# EAGLE board BoardSchem (EAGLE 9.6.2)
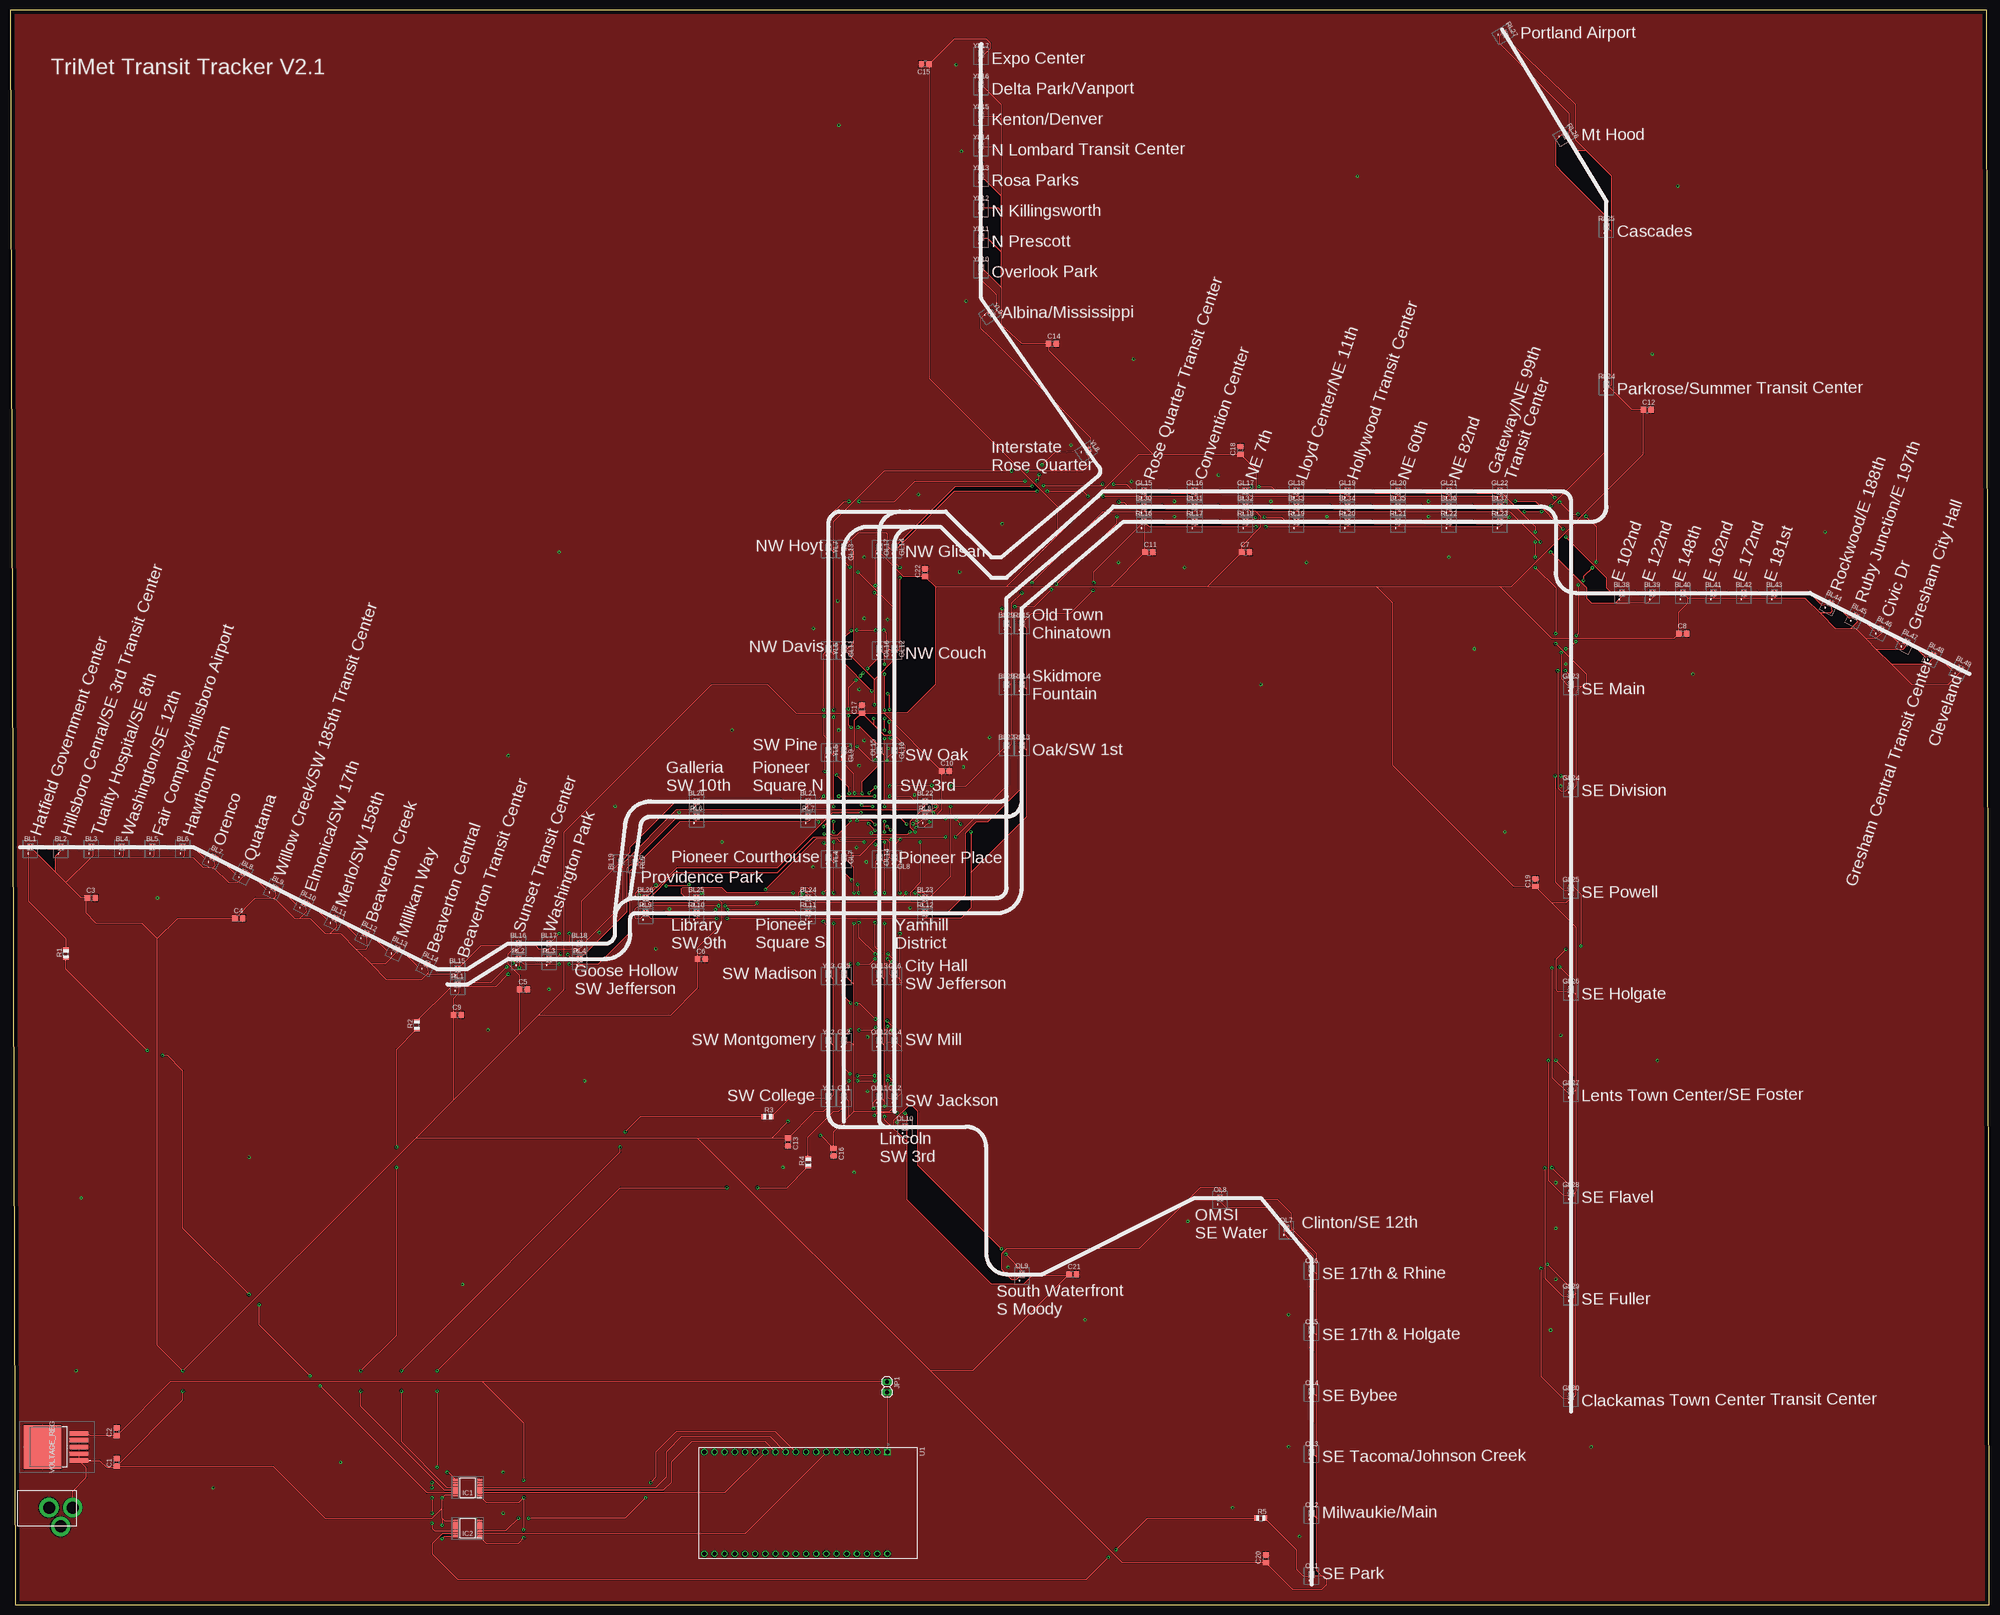
[diagram p15: board, top side]
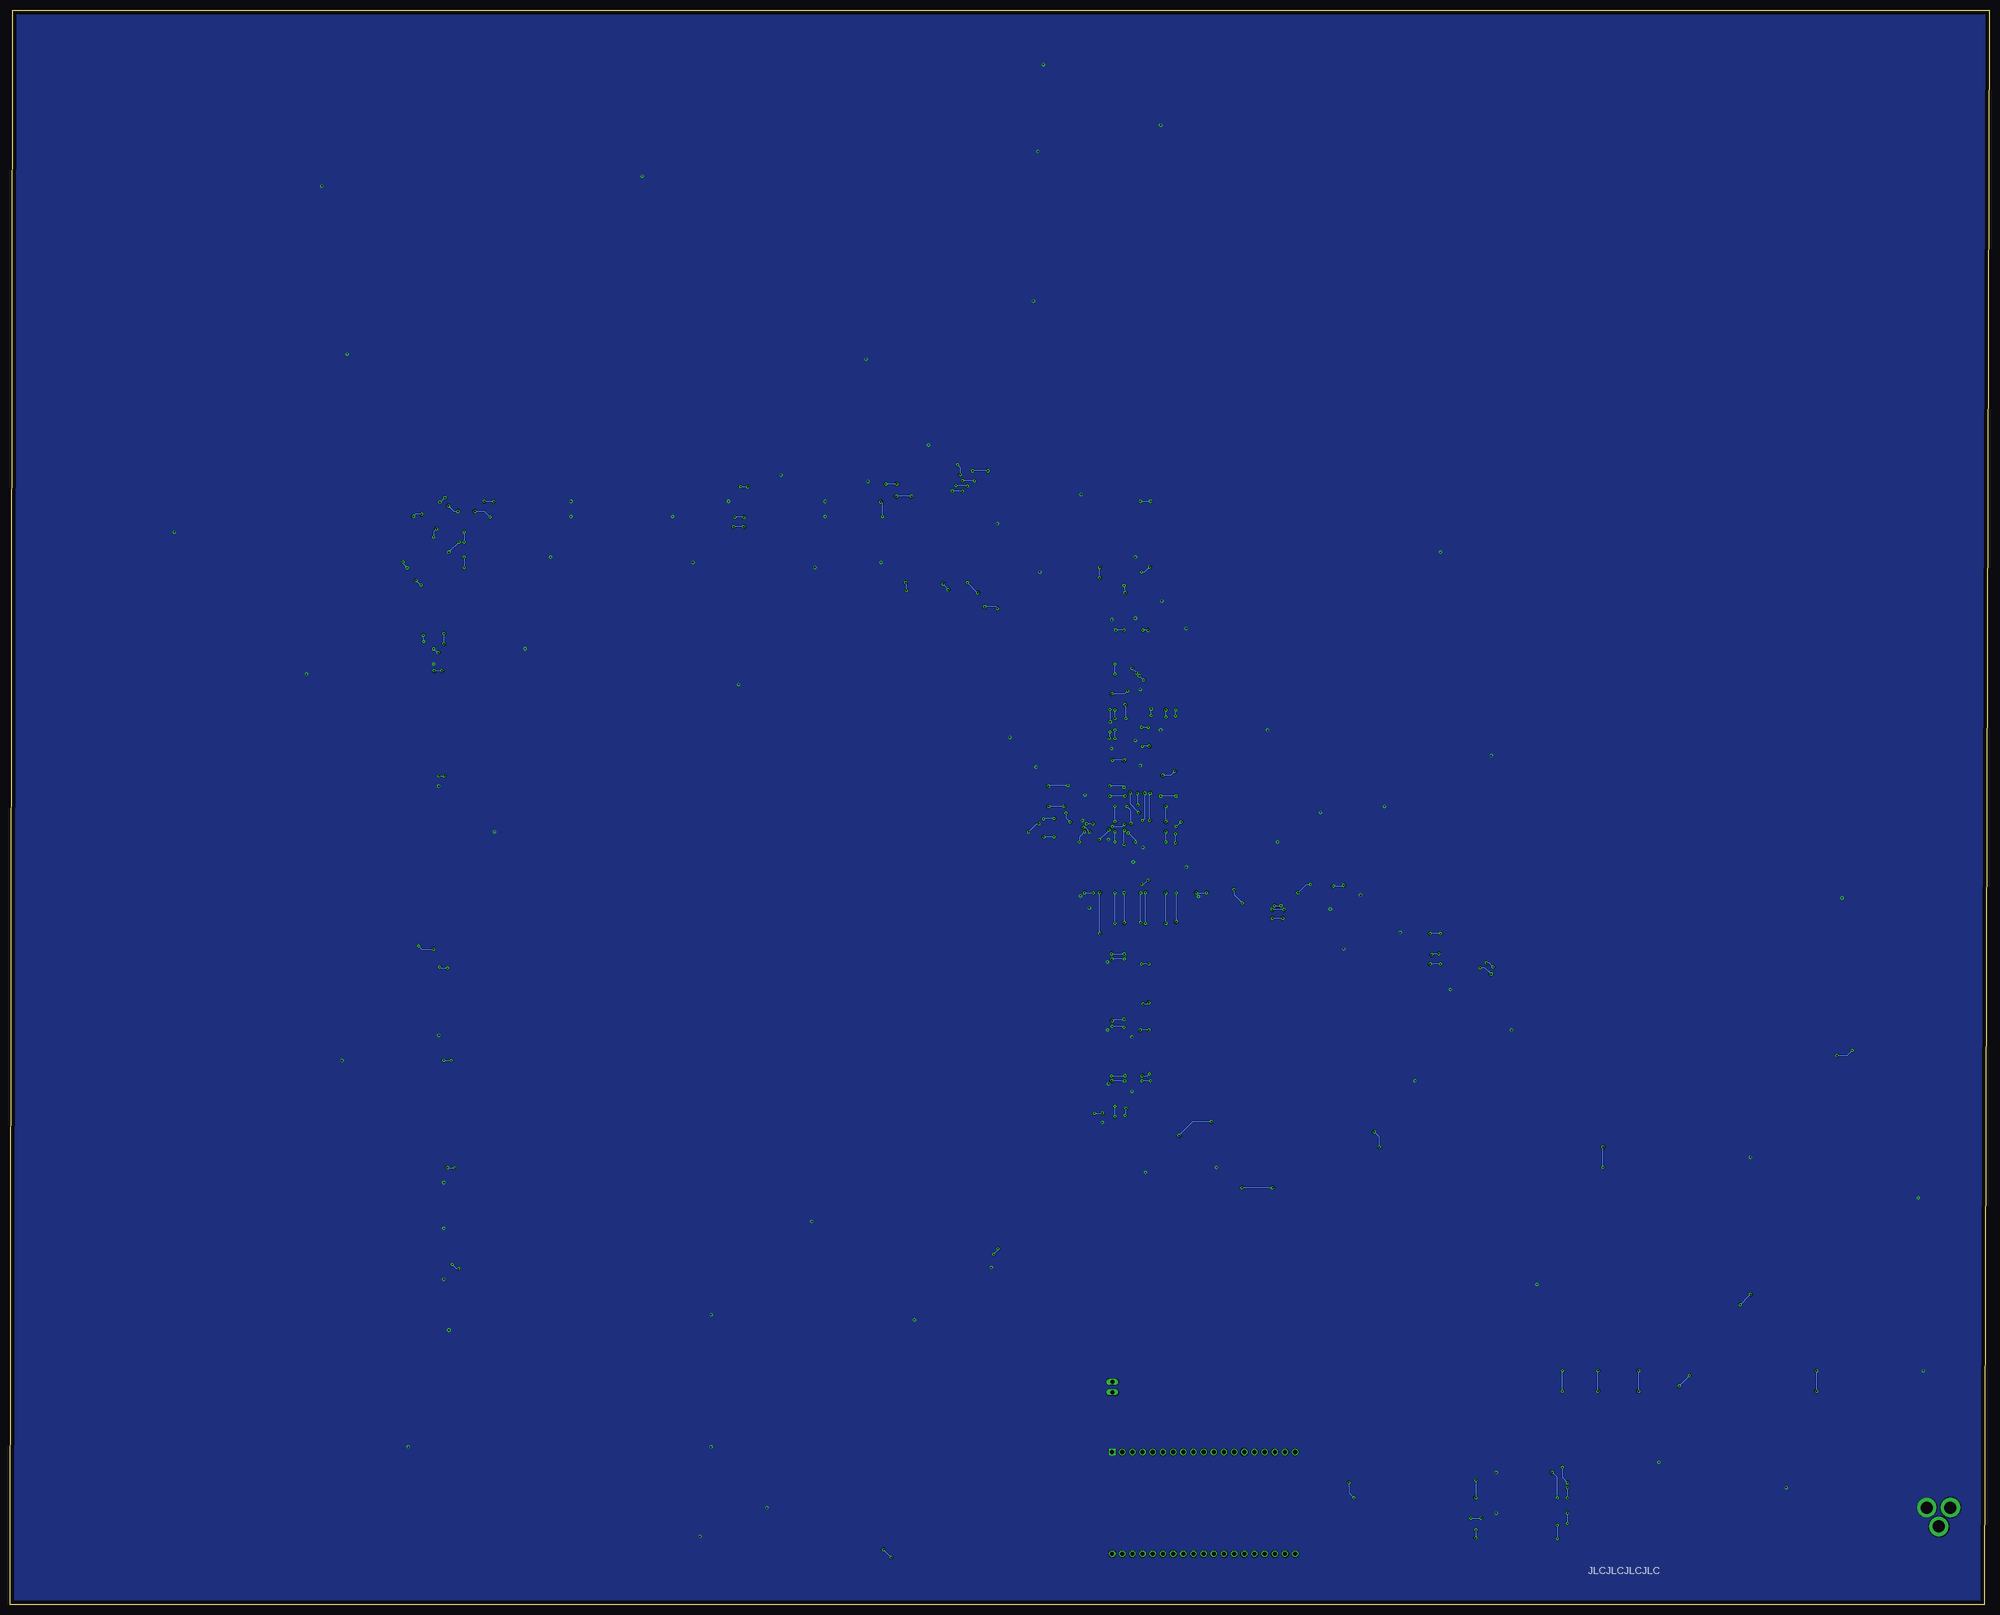
[diagram p16: board, bottom side, seen from below]

Size 494.43 x 398.33 mm. Coordinates in mm from the lower left corner, seen from the top.
Outline: 1.27,0 494.43,0 493.68,398.24 0,398.33 1.27,0
Copper layers (1*16): Top 0.035mm / dielectric 1.5mm / Bottom 0.035mm
Design rules "default": minimum track width 6mil, minimum drill 0.35mm, track to track 6mil, track to pad 6mil, pad to pad 6mil, via to via 6mil, smd to smd 6mil, copper to edge 40mil, drill to drill 6mil, minimum pad ring 10mil, minimum via ring 8mil, stop-mask expansion 4mil, vias tented up to drill 0mil, thermal gap 10mil
Net classes: 1 5v_power: width 1 mm

## Footprints (pad centres in the part's own frame; a part is rotated, then mirrored left to right if it is on the bottom)
PJ-102A = drill 3 pad 4.8: RING 0.1,-3.39; RING_SW -4.6,-6.29; TIP 0.1,-9.29
4492SK6805EC15 = smd 0.55 x 0.55: 1 -0.475,-0.475; 2 0.475,-0.475; 3 0.475,0.475; 4 -0.475,0.475
C0805 = smd 1.3 x 1.5: 1 -0.95,0; 2 0.95,0
SOP65P640X120-14N = smd 1.475 x 0.45: 1 -2.938,1.95; 2 -2.938,1.3; 3 -2.938,0.65; 4 -2.938,0; 5 -2.938,-0.65; 6 -2.938,-1.3; 7 -2.938,-1.95; 8 2.938,-1.95; 9 2.938,-1.3; 10 2.938,-0.65; 11 2.938,0; 12 2.938,0.65; 13 2.938,1.3; 14 2.938,1.95
1X02 = drill 1.016 long: 1 -1.27,0; 2 1.27,0
R0805 = smd 1.1 x 1.4: 1 -1,0; 2 1,0
MODULE_ESP32-DEVKITC-32D = drill 1.04 square: 1 -12.7,19.76 | drill 1.04: 2 -12.7,17.22; 3 -12.7,14.68; 4 -12.7,12.14; 5 -12.7,9.6; 6 -12.7,7.06; 7 -12.7,4.52; 8 -12.7,1.98; 9 -12.7,-0.56; 10 -12.7,-3.1; 11 -12.7,-5.64; 12 -12.7,-8.18; 13 -12.7,-10.72; 14 -12.7,-13.26; 15 -12.7,-15.8; 16 -12.7,-18.34; 17 -12.7,-20.88; 18 -12.7,-23.42; 19 -12.7,-25.96; 20 12.7,19.76; 21 12.7,17.22; 22 12.7,14.68; 23 12.7,12.14; 24 12.7,9.6; 25 12.7,7.06; 26 12.7,4.52; 27 12.7,1.98; 28 12.7,-0.56; 29 12.7,-3.1; 30 12.7,-5.64; 31 12.7,-8.18; 32 12.7,-10.72; 33 12.7,-13.26; 34 12.7,-15.8; 35 12.7,-18.34; 36 12.7,-20.88; 37 12.7,-23.42; 38 12.7,-25.96
TLS850B0TBV33ATMA1 = smd 1.1 x 4.6: 1 -3.4,-12.2; 2 -1.7,-12.2; 3 0,-12.2; 4 1.7,-12.2; 5 3.4,-12.2 | smd 10.8 x 9.4: 6 0,-3.05

## Placement (x,y rotation side)
BARREL_JACK1  2.1MMJACKTHM  [PJ-102A]  6.35,24.13 90 top
BL1  4492__SK6805-EC_15_  [4492SK6805EC15]  5.08,189.23 0 top
BL2  4492__SK6805-EC_15_  [4492SK6805EC15]  12.7,189.23 0 top
BL3  4492__SK6805-EC_15_  [4492SK6805EC15]  20.32,189.23 0 top
BL4  4492__SK6805-EC_15_  [4492SK6805EC15]  27.94,189.23 0 top
BL5  4492__SK6805-EC_15_  [4492SK6805EC15]  35.56,189.23 0 top
BL6  4492__SK6805-EC_15_  [4492SK6805EC15]  43.18,189.23 0 top
BL7  4492__SK6805-EC_15_  [4492SK6805EC15]  50.8,186.69 334.1 top
BL8  4492__SK6805-EC_15_  [4492SK6805EC15]  58.42,182.88 334.1 top
BL9  4492__SK6805-EC_15_  [4492SK6805EC15]  66.04,179.07 334.1 top
BL10  4492__SK6805-EC_15_  [4492SK6805EC15]  73.66,175.26 334.1 top
BL11  4492__SK6805-EC_15_  [4492SK6805EC15]  81.28,171.45 334.1 top
BL12  4492__SK6805-EC_15_  [4492SK6805EC15]  88.9,167.64 334.1 top
BL13  4492__SK6805-EC_15_  [4492SK6805EC15]  96.52,163.83 334.1 top
BL14  4492__SK6805-EC_15_  [4492SK6805EC15]  104.14,160.02 334.1 top
BL15  4492__SK6805-EC_15_  [4492SK6805EC15]  111.76,158.75 0 top
BL16  4492__SK6805-EC_15_  [4492SK6805EC15]  127,165.1 0 top
BL17  4492__SK6805-EC_15_  [4492SK6805EC15]  134.62,165.1 0 top
BL18  4492__SK6805-EC_15_  [4492SK6805EC15]  142.24,165.1 0 top
BL19  4492__SK6805-EC_15_  [4492SK6805EC15]  152.62,185.67 0 top
BL20  4492__SK6805-EC_15_  [4492SK6805EC15]  171.45,200.66 0 top
BL21  4492__SK6805-EC_15_  [4492SK6805EC15]  199.39,200.66 0 top
BL22  4492__SK6805-EC_15_  [4492SK6805EC15]  228.6,200.66 0 top
BL23  4492__SK6805-EC_15_  [4492SK6805EC15]  228.6,176.53 0 top
BL24  4492__SK6805-EC_15_  [4492SK6805EC15]  199.39,176.53 0 top
BL25  4492__SK6805-EC_15_  [4492SK6805EC15]  171.45,176.53 0 top
BL26  4492__SK6805-EC_15_  [4492SK6805EC15]  158.75,176.53 0 top
BL27  4492__SK6805-EC_15_  [4492SK6805EC15]  248.92,214.63 0 top
BL28  4492__SK6805-EC_15_  [4492SK6805EC15]  248.92,229.87 0 top
BL29  4492__SK6805-EC_15_  [4492SK6805EC15]  248.92,245.11 0 top
BL30  4492__SK6805-EC_15_  [4492SK6805EC15]  283.21,274.32 0 top
BL31  4492__SK6805-EC_15_  [4492SK6805EC15]  295.91,274.32 0 top
BL32  4492__SK6805-EC_15_  [4492SK6805EC15]  308.61,274.32 0 top
BL33  4492__SK6805-EC_15_  [4492SK6805EC15]  321.31,274.32 0 top
BL34  4492__SK6805-EC_15_  [4492SK6805EC15]  334.01,274.32 0 top
BL35  4492__SK6805-EC_15_  [4492SK6805EC15]  346.71,274.32 0 top
BL36  4492__SK6805-EC_15_  [4492SK6805EC15]  359.41,274.32 0 top
BL37  4492__SK6805-EC_15_  [4492SK6805EC15]  372.11,274.32 0 top
BL38  4492__SK6805-EC_15_  [4492SK6805EC15]  402.59,252.73 0 top
BL39  4492__SK6805-EC_15_  [4492SK6805EC15]  410.21,252.73 0 top
BL40  4492__SK6805-EC_15_  [4492SK6805EC15]  417.83,252.73 0 top
BL41  4492__SK6805-EC_15_  [4492SK6805EC15]  425.45,252.73 0 top
BL42  4492__SK6805-EC_15_  [4492SK6805EC15]  433.07,252.73 0 top
BL43  4492__SK6805-EC_15_  [4492SK6805EC15]  440.69,252.73 0 top
BL44  4492__SK6805-EC_15_  [4492SK6805EC15]  454.66,250.19 332.5 top
BL45  4492__SK6805-EC_15_  [4492SK6805EC15]  461.02,246.92 332.5 top
BL46  4492__SK6805-EC_15_  [4492SK6805EC15]  467.32,243.72 332.5 top
BL47  4492__SK6805-EC_15_  [4492SK6805EC15]  473.68,240.48 332.5 top
BL48  4492__SK6805-EC_15_  [4492SK6805EC15]  480.26,237.19 332.5 top
BL49  4492__SK6805-EC_15_  [4492SK6805EC15]  487.1,233.78 332.5 top
C1  .1uF  [C0805]  26.67,35.56 90 top
C2  2.2uF  [C0805]  26.67,43.18 90 top
C3  .1uF  [C0805]  20.32,176.53 0 top
C4  .1uF  [C0805]  57.15,171.45 0 top
C5  .1uF  [C0805]  128.27,153.67 0 top
C6  .1uF  [C0805]  172.72,161.29 0 top
C7  .1uF  [C0805]  308.61,262.89 0 top
C8  .1uF  [C0805]  417.83,242.57 0 top
C9  .1uF  [C0805]  111.76,147.32 0 top
C10  .1uF  [C0805]  233.68,208.28 0 top
C11  .1uF  [C0805]  284.48,262.89 0 top
C12  .1uF  [C0805]  408.94,298.45 0 top
C13  .1uF  [C0805]  194.31,115.57 270 top
C14  .1uF  [C0805]  260.35,314.96 0 top
C15  .1uF  [C0805]  228.6,384.81 180 top
C16  .1uF  [C0805]  205.74,113.03 270 top
C17  .1uF  [C0805]  212.77,223.69 90 top
C18  .1uF  [C0805]  307.34,288.29 90 top
C19  .1uF  [C0805]  381,180.34 90 top
C20  .1uF  [C0805]  313.69,11.43 90 top
C21  .1uF  [C0805]  265.43,82.55 0 top
C22  .1uF  [C0805]  228.6,257.81 90 top
GL1  4492__SK6805-EC_15_  [4492SK6805EC15]  208.28,127 0 top
GL2  4492__SK6805-EC_15_  [4492SK6805EC15]  220.98,127 0 top
GL3  4492__SK6805-EC_15_  [4492SK6805EC15]  208.28,140.97 0 top
GL4  4492__SK6805-EC_15_  [4492SK6805EC15]  220.98,140.97 0 top
GL5  4492__SK6805-EC_15_  [4492SK6805EC15]  208.28,157.48 0 top
GL6  4492__SK6805-EC_15_  [4492SK6805EC15]  220.98,157.48 0 top
GL7  4492__SK6805-EC_15_  [4492SK6805EC15]  208.28,186.69 0 top
GL8  4492__SK6805-EC_15_  [4492SK6805EC15]  220.98,186.69 0 top
GL9  4492__SK6805-EC_15_  [4492SK6805EC15]  208.28,213.36 0 top
GL10  4492__SK6805-EC_15_  [4492SK6805EC15]  220.98,213.36 0 top
GL11  4492__SK6805-EC_15_  [4492SK6805EC15]  208.28,238.76 0 top
GL12  4492__SK6805-EC_15_  [4492SK6805EC15]  220.98,238.76 0 top
GL13  4492__SK6805-EC_15_  [4492SK6805EC15]  208.28,264.16 0 top
GL14  4492__SK6805-EC_15_  [4492SK6805EC15]  220.98,264.16 0 top
GL15  4492__SK6805-EC_15_  [4492SK6805EC15]  283.21,278.13 0 top
GL16  4492__SK6805-EC_15_  [4492SK6805EC15]  295.91,278.13 0 top
GL17  4492__SK6805-EC_15_  [4492SK6805EC15]  308.61,278.13 0 top
GL18  4492__SK6805-EC_15_  [4492SK6805EC15]  321.31,278.13 0 top
GL19  4492__SK6805-EC_15_  [4492SK6805EC15]  334.01,278.13 0 top
GL20  4492__SK6805-EC_15_  [4492SK6805EC15]  346.71,278.13 0 top
GL21  4492__SK6805-EC_15_  [4492SK6805EC15]  359.41,278.13 0 top
GL22  4492__SK6805-EC_15_  [4492SK6805EC15]  372.11,278.13 0 top
GL23  4492__SK6805-EC_15_  [4492SK6805EC15]  389.89,229.87 0 top
GL24  4492__SK6805-EC_15_  [4492SK6805EC15]  389.89,204.47 0 top
GL25  4492__SK6805-EC_15_  [4492SK6805EC15]  389.89,179.07 0 top
GL26  4492__SK6805-EC_15_  [4492SK6805EC15]  389.89,153.67 0 top
GL27  4492__SK6805-EC_15_  [4492SK6805EC15]  389.89,128.27 0 top
GL28  4492__SK6805-EC_15_  [4492SK6805EC15]  389.89,102.87 0 top
GL29  4492__SK6805-EC_15_  [4492SK6805EC15]  389.89,77.47 0 top
GL30  4492__SK6805-EC_15_  [4492SK6805EC15]  389.89,52.07 0 top
IC1  TXU0304PWR  [SOP65P640X120-14N]  114.3,29.21 180 top
IC2  TXU0304PWR  [SOP65P640X120-14N]  114.3,19.05 180 top
JP1  [1X02]  219.07,54.36 270 top
OL1  4492__SK6805-EC_15_  [4492SK6805EC15]  325.12,7.62 0 top
OL2  4492__SK6805-EC_15_  [4492SK6805EC15]  325.12,22.86 0 top
OL3  4492__SK6805-EC_15_  [4492SK6805EC15]  325.12,38.1 0 top
OL4  4492__SK6805-EC_15_  [4492SK6805EC15]  325.12,53.34 0 top
OL5  4492__SK6805-EC_15_  [4492SK6805EC15]  325.12,68.58 0 top
OL6  4492__SK6805-EC_15_  [4492SK6805EC15]  325.12,83.82 0 top
OL7  4492__SK6805-EC_15_  [4492SK6805EC15]  318.77,93.98 0 top
OL8  4492__SK6805-EC_15_  [4492SK6805EC15]  302.26,101.6 0 top
OL9  4492__SK6805-EC_15_  [4492SK6805EC15]  252.73,82.55 0 top
OL10  4492__SK6805-EC_15_  [4492SK6805EC15]  223.52,119.38 0 top
OL11  4492__SK6805-EC_15_  [4492SK6805EC15]  217.17,127 0 top
OL12  4492__SK6805-EC_15_  [4492SK6805EC15]  217.17,140.97 0 top
OL13  4492__SK6805-EC_15_  [4492SK6805EC15]  217.17,157.48 0 top
OL14  4492__SK6805-EC_15_  [4492SK6805EC15]  217.17,186.69 0 top
OL15  4492__SK6805-EC_15_  [4492SK6805EC15]  217.17,213.36 0 top
OL16  4492__SK6805-EC_15_  [4492SK6805EC15]  217.17,238.76 0 top
OL17  4492__SK6805-EC_15_  [4492SK6805EC15]  217.17,264.16 0 top
R1  500  [R0805]  13.97,162.56 90 top
R2  500  [R0805]  101.6,144.78 90 top
R3  500  [R0805]  189.23,121.92 0 top
R4  500  [R0805]  199.39,110.49 90 top
R5  500  [R0805]  312.42,21.59 0 top
RL1  4492__SK6805-EC_15_  [4492SK6805EC15]  111.76,154.94 0 top
RL2  4492__SK6805-EC_15_  [4492SK6805EC15]  127,161.29 0 top
RL3  4492__SK6805-EC_15_  [4492SK6805EC15]  134.62,161.29 0 top
RL4  4492__SK6805-EC_15_  [4492SK6805EC15]  142.24,161.29 0 top
RL5  4492__SK6805-EC_15_  [4492SK6805EC15]  156.21,185.42 0 top
RL6  4492__SK6805-EC_15_  [4492SK6805EC15]  171.45,196.85 0 top
RL7  4492__SK6805-EC_15_  [4492SK6805EC15]  199.39,196.85 0 top
RL8  4492__SK6805-EC_15_  [4492SK6805EC15]  228.6,196.85 0 top
RL9  4492__SK6805-EC_15_  [4492SK6805EC15]  158.75,172.72 0 top
RL10  4492__SK6805-EC_15_  [4492SK6805EC15]  171.45,172.72 0 top
RL11  4492__SK6805-EC_15_  [4492SK6805EC15]  199.39,172.72 0 top
RL12  4492__SK6805-EC_15_  [4492SK6805EC15]  228.6,172.72 0 top
RL13  4492__SK6805-EC_15_  [4492SK6805EC15]  252.73,214.63 0 top
RL14  4492__SK6805-EC_15_  [4492SK6805EC15]  252.73,229.87 0 top
RL15  4492__SK6805-EC_15_  [4492SK6805EC15]  252.73,245.11 0 top
RL16  4492__SK6805-EC_15_  [4492SK6805EC15]  283.21,270.51 0 top
RL17  4492__SK6805-EC_15_  [4492SK6805EC15]  295.91,270.51 0 top
RL18  4492__SK6805-EC_15_  [4492SK6805EC15]  308.61,270.51 0 top
RL19  4492__SK6805-EC_15_  [4492SK6805EC15]  321.31,270.51 0 top
RL20  4492__SK6805-EC_15_  [4492SK6805EC15]  334.01,270.51 0 top
RL21  4492__SK6805-EC_15_  [4492SK6805EC15]  346.71,270.51 0 top
RL22  4492__SK6805-EC_15_  [4492SK6805EC15]  359.41,270.51 0 top
RL23  4492__SK6805-EC_15_  [4492SK6805EC15]  372.11,270.51 0 top
RL24  4492__SK6805-EC_15_  [4492SK6805EC15]  398.78,304.8 0 top
RL25  4492__SK6805-EC_15_  [4492SK6805EC15]  398.78,344.17 0 top
RL26  4492__SK6805-EC_15_  [4492SK6805EC15]  388.62,367.03 301.2 top
RL27  4492__SK6805-EC_15_  [4492SK6805EC15]  373.38,392.43 301.2 top
U1  ESP32-DEVKITC-32D  [MODULE_ESP32-DEVKITC-32D]  199.39,25.4 270 top
VOLTAGE_REG  TLS850B0TBV33ATMA1  [TLS850B0TBV33ATMA1]  5.08,39.37 90 top
YL1  4492__SK6805-EC_15_  [4492SK6805EC15]  204.47,127 0 top
YL2  4492__SK6805-EC_15_  [4492SK6805EC15]  204.47,140.97 0 top
YL3  4492__SK6805-EC_15_  [4492SK6805EC15]  204.47,157.48 0 top
YL4  4492__SK6805-EC_15_  [4492SK6805EC15]  204.47,186.69 0 top
YL5  4492__SK6805-EC_15_  [4492SK6805EC15]  204.47,213.36 0 top
YL6  4492__SK6805-EC_15_  [4492SK6805EC15]  204.47,238.76 0 top
YL7  4492__SK6805-EC_15_  [4492SK6805EC15]  204.47,264.16 0 top
YL8  4492__SK6805-EC_15_  [4492SK6805EC15]  269.24,288.29 303.9 top
YL9  4492__SK6805-EC_15_  [4492SK6805EC15]  245.11,322.58 303.9 top
YL10  4492__SK6805-EC_15_  [4492SK6805EC15]  242.57,334.01 0 top
YL11  4492__SK6805-EC_15_  [4492SK6805EC15]  242.57,341.63 0 top
YL12  4492__SK6805-EC_15_  [4492SK6805EC15]  242.57,349.25 0 top
YL13  4492__SK6805-EC_15_  [4492SK6805EC15]  242.57,356.87 0 top
YL14  4492__SK6805-EC_15_  [4492SK6805EC15]  242.57,364.49 0 top
YL15  4492__SK6805-EC_15_  [4492SK6805EC15]  242.57,372.11 0 top
YL16  4492__SK6805-EC_15_  [4492SK6805EC15]  242.57,379.73 0 top
YL17  4492__SK6805-EC_15_  [4492SK6805EC15]  242.57,387.35 0 top

## Tracks (layer width: path | path; a pad name or v marks a point on that pad's centre or on a via)
+3V3  (via drill 0.35)
  Top 0.152: JP1.1 118.11,55.63 | 118.11,55.63 40.06,55.63 C2.1 20,42.23 19.05,43.18 17.69,43.18 VOLTAGE_REG.5 | 118.11,55.63 128.27,45.46 v128.27,31.07 | IC1.1 119.1,25.4 127,25.4 v128.33,26.74 128.33,18.7 v128.28,18.65 | v128.33,16.67 126.9,15.24 119.1,15.24 IC2.1
  Bottom 0.152: v128.27,31.07 128.27,26.8 v128.33,26.74 | v128.28,18.65 128.28,16.72 v128.33,16.67
+5V  (via drill 0.35)
  Top 0.152: BARREL_JACK1.TIP 15.64,28.34 19.05,31.75 19.05,34.2 VOLTAGE_REG.1 | VOLTAGE_REG.1 VOLTAGE_REG.2 | VOLTAGE_REG.1 22.45,35.97 24.13,34.29 26.35,34.29 C1.1 | RL8.2 230.66,196.38 | 230.66,196.38 232.73,198.44 C10.1 218.27,222.74 | 419.1,251.46 419.1,250.19 416.88,247.97 C8.1 415.61,241.3 385.13,241.3 372.11,254.32 | 419.1,251.46 BL40.2 | 248.72,318.56 252.73,314.96 C14.1 259.4,313.37 285.43,287.34 | 248.72,318.56 YL9.2 | YL17.2 244.95,388.78 244.95,390.05 243.84,391.16 235.9,391.16 C15.1 229.55,306.39 261.62,274.32 261.62,267.02 | 209.55,121.92 205.74,118.11 C16.1 202.56,117.15 v202.42,117.15 | 209.55,121.92 209.55,125.73 GL1.2 | C17.1 210.82,220.79 210.82,213.36 210.34,212.88 GL9.2 | 385.13,175.26 C19.1 375.6,179.39 345.44,209.55 345.44,250.19 341.31,254.32 | 391.16,152.4 GL26.2 | 327.66,7.15 328.13,7.15 328.93,6.35 328.93,5.08 327.66,3.81 320.36,3.81 C20.1 277.81,10.48 229.87,58.42 | 327.66,7.15 OL1.2 | 255.27,82.07 264,82.07 C21.1 240.35,58.42 229.87,58.42 | 255.27,82.07 OL9.2 | OL17.2 217.64,262.42 223.2,256.86 C22.1 231.14,254.32 | v43.18,53.34 43.18,51.12 C1.1 | C3.1 19.05,176.53 | 19.05,176.53 17.78,176.53 13.97,180.34 | 13.97,180.34 11.43,182.88 | 11.43,182.88 BL1.2 | 36.83,166.37 36.83,64.77 v43.18,58.42 101.28,116.52 | 36.83,166.37 33.02,170.18 21.59,170.18 19.05,172.72 19.05,176.53 | 36.83,166.37 41.91,171.45 C4.1 61.28,176.53 66.04,176.53 | 101.28,116.52 110.81,126.05 | 110.81,126.05 C9.1 110.81,151.45 112.23,152.88 RL1.2 121.44,154.47 v124.46,157.48 | 110.81,126.05 127.32,142.56 | 127.32,142.56 C5.1 127.32,157.16 124.46,160.02 124.46,162.56 125.37,163.47 126.75,163.47 127.47,164.2 BL16.2 131.28,164.62 132.08,163.83 134.62,163.83
  Top 0.152: 127.32,142.56 132.08,147.32 | 132.08,147.32 165.1,147.32 171.77,153.99 C6.1 171.77,164.15 177.8,170.18 177.8,175.26 177,176.06 BL25.2 171.92,175.73 171.45,175.26 160.02,175.26 BL26.2 166.05,182.88 191.77,182.88 200.66,191.77 v233.68,191.77 | 190.18,116.52 C13.1 200.98,123.19 203.2,123.19 204.94,124.94 YL1.2 205.74,127.32 205.74,139.7 | 190.18,116.52 171.77,116.52 | 171.77,116.52 101.28,116.52 | v194.31,120.65 190.18,116.52 | 132.08,147.32 138.43,153.67 138.43,193.04 175.26,229.87 189.23,229.87 196.36,222.74 C17.1 | C17.1 218.27,222.74 | 231.14,254.32 231.14,229.87 224,222.74 218.27,222.74 | 231.14,254.32 248.92,254.32 | 248.92,254.32 274.96,254.32 | 274.96,254.32 C11.1 283.53,269.88 RL16.2 284.48,269.24 295.91,269.24 | 229.87,58.42 171.77,116.52 | 299.09,254.32 C7.1 307.66,264.48 312.42,269.24 312.42,271.78 311.15,273.05 | 299.09,254.32 274.96,254.32 | 248.92,254.32 261.62,267.02 | 261.62,267.02 281.94,287.34 285.43,287.34 | 285.43,287.34 C18.1 311.15,283.53 311.15,278.13 310.67,277.66 GL17.2 309.88,276.86 321.31,276.86 | 299.09,254.32 341.31,254.32 | 341.31,254.32 372.11,254.32 | 372.11,254.32 374.97,254.32 407.99,287.34 C12.1 405.13,298.45 RL24.2 399.57,304.33 400.05,304.8 400.05,342.9 | 11.43,182.88 11.43,187.01 BL2.2 | 13.97,180.34 20.32,186.69 | 20.32,186.69 20.79,187.16 BL3.2 | 20.32,186.69 27.94,186.69 | 27.94,186.69 28.41,187.16 BL4.2 | 27.94,186.69 35.56,186.69 | 35.56,186.69 36.03,187.16 BL5.2 | 35.56,186.69 43.18,186.69 | 43.18,186.69 43.65,187.16 BL6.2 | 43.18,186.69 45.72,186.69 48.26,184.15 50.8,184.15 | 50.8,184.15 51.27,184.62 BL7.2 | 50.8,184.15 54.61,180.34 56.83,180.34 BL8.2
  Top 0.152: 66.04,176.53 66.51,177 BL9.2 | 66.04,176.53 71.12,171.45 72.39,171.45 | 72.39,171.45 74.13,173.19 BL10.2 | 72.39,171.45 74.93,171.45 78.74,167.64 80.01,167.64 | 80.01,167.64 81.75,169.38 BL11.2 | 80.01,167.64 82.55,167.64 86.36,163.83 | BL12.2 89.37,164.31 88.9,163.83 86.36,163.83 | 86.36,163.83 90.17,160.02 | BL13.2 93.66,160.02 90.17,160.02 | 90.17,160.02 93.98,156.21 102.87,156.21 104.14,157.48 | 104.14,157.48 104.61,157.95 BL14.2 | 104.14,157.48 111.76,157.48 112.23,157.95 BL15.2 | 134.62,163.83 135.09,164.31 BL17.2 | 134.62,163.83 142.24,163.83 142.71,164.31 BL18.2 153.1,175.01 BL19.2 166.5,198.6 170.34,198.6 | BL20.2 170.34,198.6 | 170.34,198.6 198.28,198.6 | 198.28,198.6 BL21.2 | 198.28,198.6 227.49,198.6 | BL22.2 227.49,198.6 | 227.49,198.6 230.35,198.6 v231.14,199.39 | v234.95,199.39 234.95,181.93 BL23.2 228.28,175.26 200.66,175.26 BL24.2 | v236.22,191.77 249.39,204.94 BL27.2 250.19,214.95 250.19,230.19 | BL28.2 250.19,230.19 | 250.19,243.84 BL29.2 | 250.19,230.19 250.19,243.84 | 250.19,243.84 250.19,250.19 v252.73,252.73 | v255.27,255.27 273.05,273.05 283.21,273.05 | 283.21,273.05 283.68,273.53 BL30.2 | 283.21,273.05 295.91,273.05 296.38,273.53 BL31.2 | 311.15,273.05 309.88,273.05 BL32.2 | 311.15,273.05 321.31,273.05 | 321.31,273.05 321.78,273.53 BL33.2 | 321.31,273.05 334.01,273.05 | 334.01,273.05 334.48,273.53 BL34.2 | 334.01,273.05 346.71,273.05 | 346.71,273.05 347.18,273.53 BL35.2 | 346.71,273.05 359.41,273.05 | 359.41,273.05 359.88,273.53 BL36.2 | 359.41,273.05 372.11,273.05 | 372.11,273.05 372.58,273.53 BL37.2 | 372.11,273.05 374.65,273.05 v382.27,265.43 | v384.81,262.89 393.7,254 393.7,251.46 394.97,250.19 401,250.19
  Top 0.152: 401,250.19 BL38.2 | BL39.2 410.68,251.93 408.94,250.19 401,250.19 | 419.1,251.46 425.45,251.46 | 425.45,251.46 425.92,251.93 BL41.2 | 425.45,251.46 433.07,251.46 | 433.07,251.46 433.54,251.93 BL42.2 | 433.07,251.46 440.69,251.46 | 440.69,251.46 441.16,251.93 BL43.2 | 440.69,251.46 448.31,251.46 452.12,247.65 | 452.12,247.65 454.66,247.65 455.13,248.12 BL44.2 | 452.12,247.65 455.93,243.84 459.74,243.84 | 459.74,243.84 461.5,245.6 BL45.2 | 459.74,243.84 461.01,243.84 463.55,241.3 | BL46.2 467.79,243 466.09,241.3 463.55,241.3 | 463.55,241.3 466.09,238.76 | BL47.2 472.91,238.76 466.09,238.76 | 466.09,238.76 469.9,234.95 | BL48.2 478.96,234.95 469.9,234.95 | 469.9,234.95 474.98,229.87 484.14,229.87 BL49.2 | 134.62,160.02 128.27,160.02 RL2.2 127.23,160.57 v127.23,159.07 | 134.62,160.02 135.09,160.5 RL3.2 | 134.62,160.02 v137.16,160.02 | v139.7,160.02 141.92,160.02 | 141.92,160.02 RL4.2 | 141.92,160.02 147,160.02 154.94,167.96 154.94,183.2 RL5.2 167.32,195.58 171.13,195.58 | RL9.2 160.02,171.45 171.45,171.45 | 171.45,171.45 171.92,171.92 RL10.2 | 171.45,171.45 v176.53,171.45 | v179.07,171.45 199.39,171.45 | 199.39,171.45 199.86,171.92 RL11.2 | 199.39,171.45 228.6,171.45 | 228.6,171.45 229.07,171.92 RL12.2 | 228.6,171.45 237.49,171.45 240.02,173.98 240.02,182.88 | 254,213.36 RL13.2 | 254,213.36 254,228.6 | 254,228.6 RL14.2 | 254,228.6 254,243.84 RL15.2 | 295.91,269.24 308.61,269.24 | 308.61,269.24 309.08,269.72 RL18.2 | RL17.2 296.38,269.72 295.91,269.24 | 308.61,269.24 v311.15,269.24 | v313.69,269.24 321.31,269.24 | 321.31,269.24 321.78,269.72 RL19.2 | 321.31,269.24 334.01,269.24 | 334.01,269.24 334.48,269.72 RL20.2
  Top 0.152: 334.01,269.24 346.71,269.24 | 346.71,269.24 347.18,269.72 RL21.2 | 346.71,269.24 359.41,269.24 | 359.41,269.24 359.88,269.72 RL22.2 | 359.41,269.24 372.11,269.24 372.58,269.72 RL23.2 | 400.05,342.9 RL25.2 | 400.05,342.9 400.05,356.87 393.7,363.22 | 393.7,363.22 391.16,365.76 391.16,374.65 RL27.2 | 171.13,195.58 RL6.2 | 171.13,195.58 199.39,195.58 199.86,196.06 RL7.2 | 230.66,196.38 v233.61,196.38 | v236.29,196.26 237.46,195.09 v237.46,195.01 | v240.02,193.06 240.02,182.88 | 240.02,182.88 254,196.86 254,213.36 | YL2.2 205.74,139.7 | 205.74,139.7 205.74,156.21 | YL3.2 205.74,156.21 | 205.74,156.21 v205.74,170.18 | v205.74,177.8 205.74,185.42 | 205.74,185.42 YL4.2 | 205.74,185.42 v205.74,190.5 | v205.74,193.04 v205.74,195.58 | v205.74,199.39 205.74,212.09 | 205.74,212.09 YL5.2 | 205.74,212.09 205.74,221.66 v205.7,221.7 | v205.74,223.52 205.74,237.49 | 205.74,237.49 YL6.2 | 205.74,237.49 205.74,262.89 | YL7.2 205.74,262.89 | 205.74,262.89 205.74,270.51 218.44,283.21 v250.19,283.21 | v254,283.21 267.97,283.21 269.71,284.96 YL8.2 | 247.65,328.93 YL10.2 | 247.65,328.93 247.65,337.82 | 247.65,337.82 244.31,341.16 YL11.2 | 247.65,337.82 247.65,347.98 | 247.65,347.98 246.85,348.78 YL12.2 | 247.65,347.98 247.65,351.79 | 247.65,351.79 YL13.2 | 247.65,351.79 247.65,361.95 | 247.65,361.95 245.58,364.02 YL14.2 | 247.65,361.95 247.65,370.84 | 247.65,370.84 246.85,371.64 YL15.2 | 247.65,370.84 247.65,374.65 YL16.2 | 209.55,121.92 210.82,123.19 | 210.82,123.19 219.71,123.19 221.45,124.94 GL2.2 222.72,127.79 222.72,139.22 | 210.82,123.19 210.82,139.7 | 210.82,139.7 210.02,140.5 GL3.2 | 222.72,139.22 GL4.2 | 222.72,139.22 222.72,154.94 | 222.72,154.94 222.72,155.73 GL6.2
  Top 0.152: 210.82,139.7 210.82,154.94 | 210.82,154.94 GL5.2 | 222.72,154.94 222.25,155.41 v222.25,167.64 | v222.25,177.8 222.25,185.42 GL8.2 | 210.82,154.94 v210.82,170.18 | v210.82,177.8 210.82,184.15 GL7.2 | C17.1 215.85,219.66 | 215.85,219.66 218.33,217.17 220.98,217.17 223.52,214.63 223.52,213.36 223.04,212.88 GL10.2 | 215.85,219.66 215.85,221.21 v215.71,221.35 | v215.9,224.79 215.9,231.14 | 215.9,231.14 GL11.2 210.82,240.35 210.82,262.89 210.02,263.69 GL13.2 | 215.9,231.14 221.45,236.7 GL12.2 221.77,238.28 222.25,238.76 v222.25,256.54 | v222.25,259.08 221.45,259.88 GL14.2 235.9,278.13 v256.54,278.13 | v259.08,278.13 267.97,278.13 v269.24,276.86 | v273.05,276.86 283.21,276.86 | 283.21,276.86 283.68,277.34 GL15.2 | 283.21,276.86 295.91,276.86 296.38,277.34 GL16.2 | 321.31,276.86 321.78,277.34 GL18.2 | 333.69,276.86 GL19.2 | 321.31,276.86 333.69,276.86 | 333.69,276.86 346.39,276.86 | 346.39,276.86 GL20.2 | 346.39,276.86 359.09,276.86 | 359.09,276.86 GL21.2 | 359.09,276.86 372.11,276.86 372.58,277.34 GL22.2 381,269.24 v381,267.97 | v381,265.43 v381,261.62 | v381,259.08 386.08,254 v386.08,242.57 | v386.08,240.03 393.7,232.41 393.7,229.87 393.22,229.39 392.43,229.39 | 392.43,229.39 GL23.2 | 391.16,152.4 391.16,128.59 | 391.16,128.59 GL27.2 | 391.16,128.59 391.16,103.19 391,103.03 | 391,103.03 GL28.2 | 391.16,77.47 391.16,52.39 GL30.2 | 391.16,77.47 391.16,77.79 GL29.2 | 392.43,229.39 391.16,228.12 391.16,204.47 390.68,204 GL24.2 | 327.66,7.15 326.39,8.41 326.39,21.59 | OL2.2 326.39,21.59 | 326.39,21.59 326.39,36.83 | 326.39,36.83 OL3.2 | 326.39,36.83 326.39,52.07 | 326.39,52.07 OL4.2 | 326.39,52.07 326.39,67.31 | 326.39,67.31 OL5.2
  Top 0.152: 326.39,67.31 326.39,82.55 | 326.39,82.55 OL6.2 | 326.39,82.55 326.39,87.63 320.51,93.5 | 320.51,93.5 OL7.2 | 320.51,93.5 320.04,93.98 320.04,97.79 316.7,101.12 OL8.2 | 255.27,82.07 253.2,80.01 245.11,80.01 223.99,101.12 223.99,115.57 | 223.99,115.57 OL10.2 | 223.99,115.57 218.44,121.12 v218.44,121.92 | v218.44,124.46 218.44,125.73 | OL11.2 218.44,125.73 | 218.44,139.7 OL12.2 | 218.44,125.73 218.44,139.7 | 218.44,139.7 218.44,156.21 | 218.44,156.21 OL13.2 | 218.44,156.21 v218.44,170.18 | v218.44,177.8 218.44,185.42 | 218.44,185.42 OL14.2 | 218.44,185.42 v218.44,190.5 | v218.44,193.04 v218.44,195.58 | v218.44,199.39 218.44,212.09 | 218.44,212.09 OL15.2 | 218.44,212.09 218.44,216.38 v218.45,216.39 | v218.44,218.44 218.44,221.35 v218.46,221.37 | v218.44,223.52 v218.44,232.41 | v218.44,234.95 218.44,237.49 OL16.2 | GL25.2 390.36,177 388.62,175.26 385.13,175.26 | 391.16,152.4 391.16,169.23 385.13,175.26 | 391.16,77.47 391,77.63 391,103.03 | IC1.14 108.54,27.26 v107.95,26.67 107.95,24.13 | 107.95,24.13 107.95,21.59 107.97,21.57 | 107.97,21.57 108.54,21 IC2.8 | 107.97,21.57 v107.97,19.83 | v107.95,16.51 108.54,17.1 IC2.14 | v109.22,33.02 109.5,33.02 IC1.8 | C1.1 65.72,34.61 78.74,21.59 105.41,21.59 107.95,24.13 | 248.72,318.56 247.65,319.63 247.65,328.93 | 393.7,363.22 391.61,363.22 RL26.2
  Bottom 0.152: v43.18,53.34 v43.18,58.42 | v202.42,117.15 198.92,120.65 v194.31,120.65 | v231.14,199.39 233.97,199.39 234,199.36 234.92,199.36 v234.95,199.39 | v233.68,191.77 v236.22,191.77 | v252.73,252.73 v255.27,255.27 | v382.27,265.43 v384.81,262.89 | v124.46,157.48 126.05,159.07 v127.23,159.07 | v137.16,160.02 v139.7,160.02 | v176.53,171.45 v179.07,171.45 | v311.15,269.24 v313.69,269.24 | v233.61,196.38 236.17,196.38 v236.29,196.26 | v237.46,195.01 238.06,195.01 v240.02,193.06 | v205.74,170.18 v205.74,177.8 | v205.74,190.5 v205.74,193.04 | v205.74,195.58 v205.74,199.39 | v205.7,221.7 205.7,223.48 v205.74,223.52 | v250.19,283.21 v254,283.21 | v222.25,167.64 v222.25,177.8 | v210.82,170.18 v210.82,177.8 | v215.71,221.35 215.71,224.6 v215.9,224.79 | v222.25,256.54 v222.25,259.08 | v256.54,278.13 v259.08,278.13 | v269.24,276.86 v273.05,276.86 | v381,267.97 v381,265.43 | v381,261.62 v381,259.08 | v386.08,242.57 v386.08,240.03 | v218.44,121.92 v218.44,124.46 | v218.44,170.18 v218.44,177.8 | v218.44,190.5 v218.44,193.04 | v218.44,195.58 v218.44,199.39 | v218.45,216.39 v218.44,216.4 v218.44,218.44 | v218.46,221.37 218.44,221.39 v218.44,223.52 | v218.44,232.41 v218.44,234.95 | v107.97,19.83 107.97,16.53 v107.95,16.51 | v107.95,26.67 107.95,31.75 v109.22,33.02
BLUE_LINE  (via drill 0.35)
  Top 0.152: IC1.13 104.17,27.91 v77.47,54.61 | v74.93,57.15 62.23,69.85 v62.23,74.93 | v59.69,77.47 43.18,93.98 43.18,133.35 39.37,137.16 v38.1,137.16 | v34.29,138.43 13.97,158.75 R1.1
  Bottom 0.152: v77.47,54.61 v74.93,57.15 | v62.23,74.93 v59.69,77.47 | v38.1,137.16 35.56,137.16 v34.29,138.43
GND  (via drill 0.35)
  other vias: 16.51,58.42 50.8,29.21 123.19,33.02 17.78,101.6 59.69,111.76 113.03,80.01 36.83,176.53 119.38,143.51 134.62,153.67 143.51,130.81 161.29,163.83 177.8,190.5 151.13,199.39 124.46,212.09 180.34,218.44 137.16,262.89 207.01,369.57 280.67,311.15 336.55,356.87 416.56,354.33 354.33,275.59 314.96,275.59 290.83,275.59 290.83,271.78 328.93,271.78 354.33,271.78 359.41,261.62 323.85,260.35 293.37,259.08 276.86,260.35 312.42,229.87 373.38,193.04 365.76,238.76 387.35,204.47 388.62,234.95 420.37,232.41 411.48,135.89 387.35,142.24 386.08,105.41 386.08,93.98 386.08,81.28 384.81,68.58 394.97,39.37 453.39,267.97 410.21,312.42 220.33,160.54 220.06,191.1 213.36,261.62 213.36,246.38 219.2,246.05 206.75,250.71 247.8,269.99 237.18,257.98 226.89,277.32 197.59,176.89 207.01,218.44 212.09,209.55 213.36,215.9 212.09,228.6 200.66,243.84 167.13,197.9 147.18,167.85 193.04,109.22 210.82,107.95 221.59,120.46 214.18,128.22 220.04,130.11 225.93,202.28 238.13,209.24 226.57,195.87 244.7,216.63 219.33,213.84 268.55,71.15 249.32,84.23 319.35,72.42 319.35,39.4 305.38,24.16 322.08,17.06 294.2,95.73 280.16,280.54 301.89,282.18 265.01,289.69 238.84,325.62 237.65,363.01 236.31,384.71 227.06,177.07 213.88,185.52 211.46,189.17 200.61,184.21 224.86,174.04 157.08,177.25 164.68,173.77 214.17,141.75 220.32,143.57 123.19,22.86 82.55,35.56
  pour Top: -6.35,403.86 -6.35,-7.62 -5.08,-8.89 500.38,-8.89 501.65,-7.62 501.65,403.86 500.38,405.13 -5.08,405.13
  pour Bottom: -6.35,405.13 -6.35,-7.62 500.38,-7.62 501.65,-8.89 501.65,398.78 497.84,402.59 495.3,405.13
GREEN_LINE  (via drill 0.35)
  Top 0.152: v106.68,58.42 152.4,104.14 v179.07,104.14 | v186.69,104.14 194.04,104.14 R4.1 | v106.68,53.34 v106.68,34.29 | v105.41,30.48 v105.41,29.21 | v105.41,26.67 v105.41,22.86 | v105.41,20.32 105.41,19.05 106.06,18.4 IC2.12 | IC2.12
  Bottom 0.152: v106.68,53.34 v106.68,58.42 | v179.07,104.14 v186.69,104.14 | v106.68,34.29 106.68,31.75 v105.41,30.48 | v105.41,29.21 v105.41,26.67 | v105.41,22.86 v105.41,20.32
N$1
  Top 0.152: JP1.2 219.07,38.18 U1.1
N$2
  Top 0.152: BL1.3 8.41,189.7 9.36,188.75 BL2.1
N$3
  Top 0.152: BL2.3 16.03,189.7 16.98,188.75 BL3.1
N$4
  Top 0.152: BL3.3 23.65,189.7 24.6,188.75 BL4.1
N$5
  Top 0.152: BL4.3 31.27,189.7 32.22,188.75 BL5.1
N$6
  Top 0.152: BL5.3 38.89,189.7 39.84,188.75 BL6.1
N$7
  Top 0.152: BL6.3 45.24,189.7 48.73,186.22 BL7.1
N$8
  Top 0.152: BL7.3 51.59,187.16 56.35,182.41 BL8.1
N$9
  Top 0.152: BL8.3 59.21,183.35 63.97,178.59 BL9.1
N$10
  Top 0.152: BL9.3 66.83,179.54 71.59,174.78 BL10.1
N$11
  Top 0.152: BL10.3 74.45,175.73 79.21,170.97 BL11.1
N$12
  Top 0.152: BL11.3 86.51,167.16 BL12.1
N$13
  Top 0.152: BL12.3 94.13,163.35 BL13.1
N$14
  Top 0.152: BL13.3 101.75,159.54 BL14.1
N$15
  Top 0.152: BL14.3 106.83,158.28 BL15.1
N$16
  Top 0.152: BL15.3 117.63,164.62 BL16.1
N$17
  Top 0.152: BL16.3 133.19,165.57 BL17.1
N$18  (via drill 0.35)
  Top 0.152: BL17.3 v137.16,167.64 | v139.7,167.64 139.7,165.1 140.17,164.62 BL18.1
  Bottom 0.152: v137.16,167.64 v139.7,167.64
N$19
  Top 0.152: BL18.3 142.71,175.76 BL19.1
N$20
  Top 0.152: BL19.3 154.94,187.98 154.94,189.23 165.89,200.19 BL20.1
N$21
  Top 0.152: BL20.3 192.56,201.13 193.51,200.19 BL21.1
N$22  (via drill 0.35)
  Top 0.152: BL21.3 202.4,201.13 v203.2,201.93 | v207.01,201.93 v215.9,201.93 | v219.71,201.93 224.79,201.93 226.53,200.19 BL22.1
  Bottom 0.152: v203.2,201.93 v207.01,201.93 | v215.9,201.93 v219.71,201.93
N$23  (via drill 0.35)
  Top 0.152: BL22.3 230.21,200 231.39,200 231.74,199.64 231.74,199.14 230.9,198.3 227.5,198.3 224.79,195.58 224.79,194.31 v226.06,193.04 | v227.33,190.5 227.33,180.34 224.79,177.8 224.79,176.53 225.26,176.06 BL23.1
  Bottom 0.152: v226.06,193.04 227.33,191.77 v227.33,190.5
N$24  (via drill 0.35)
  Top 0.152: BL23.3 228.28,177.8 v226.06,177.8 | v223.82,177.77 222.58,176.53 201.93,176.53 199.39,179.07 198.12,179.07 196.85,177.8 196.85,176.53 197.32,176.06 BL24.1
  Bottom 0.152: v226.06,177.8 226.03,177.77 v223.82,177.77
N$25  (via drill 0.35)
  Top 0.152: BL24.3 199.07,177.8 v198.12,177.8 | v195.58,177.8 179.07,177.8 177.8,179.07 167.96,179.07 167.64,178.75 167.64,177.8 169.38,176.06 BL25.1
  Bottom 0.152: v198.12,177.8 v195.58,177.8
N$26  (via drill 0.35)
  Top 0.152: BL25.3 v172.72,177.8 | v169.59,179.89 169.22,179.52 v163.9,179.52 | v161.33,179.7 160.36,178.73 157.14,178.73 156.21,177.8 156.21,176.53 156.68,176.06 BL26.1
  Bottom 0.152: v172.72,177.8 170.63,179.89 v169.59,179.89 | v163.9,179.52 161.51,179.52 v161.33,179.7
N$27  (via drill 0.35)
  Top 0.152: BL26.3 161.31,179.09 161.58,179.09 166.64,184.15 191.77,184.15 205.46,197.85 v212.51,197.85 | v214.61,202.78 216.01,204.17 v216.2,204.17 | v219.71,204.47 219.86,204.63 v230.23,204.63 | v235.07,204.47 238.76,204.47 BL27.1
  Bottom 0.152: v212.51,197.85 214.61,199.95 v214.61,202.78 | v216.2,204.17 216.5,204.47 v219.71,204.47 | v230.23,204.63 234.92,204.63 v235.07,204.47
N$28
  Top 0.152: BL27.3 248.44,216.06 BL28.1
N$29
  Top 0.152: BL28.3 248.44,231.29 BL29.1
N$30  (via drill 0.35)
  Top 0.152: BL29.3 247.79,247.19 v247.79,248.86 | v250.96,249.27 255.83,249.27 v260.1,253.53 | v261.34,254.99 276.49,270.14 v276.49,271.81 | v276.94,275.46 278.26,275.46 279.87,273.85 BL30.1
  Bottom 0.152: v247.79,248.86 248.19,249.27 v250.96,249.27 | v260.1,253.53 260.1,253.74 v261.34,254.99 | v276.49,271.81 276.49,275.01 v276.94,275.46
N$31
  Top 0.152: BL30.3 287.81,274.8 288.76,273.85 BL31.1
N$32
  Top 0.152: BL31.3 301.78,274.8 302.73,273.85 BL32.1
N$33
  Top 0.152: BL32.3 314.48,274.8 315.43,273.85 BL33.1
N$34
  Top 0.152: BL33.3 329.72,274.8 330.67,273.85 BL34.1
N$35
  Top 0.152: BL34.3 339.88,274.8 340.83,273.85 BL35.1
N$36
  Top 0.152: BL35.3 352.58,274.8 353.53,273.85 BL36.1
N$37
  Top 0.152: BL36.3 365.28,274.8 366.23,273.85 BL37.1
N$38  (via drill 0.35)
  Top 0.152: BL37.3 373.26,275.47 v373.61,275.47 | v375.97,275.62 380.99,275.62 v387.9,268.71 | v388.62,266.7 398.78,256.54 398.78,254 400.52,252.25 BL38.1
  Bottom 0.152: v373.61,275.47 375.83,275.47 v375.97,275.62 | v387.9,268.71 388.62,267.99 v388.62,266.7
N$39
  Top 0.152: BL38.3 405.92,253.21 406.87,252.25 BL39.1
N$40
  Top 0.152: BL39.3 413.54,253.21 414.49,252.25 BL40.1
N$41
  Top 0.152: BL40.3 421.16,253.21 422.11,252.25 BL41.1
N$42
  Top 0.152: BL41.3 428.78,253.21 429.73,252.25 BL42.1
N$43
  Top 0.152: BL42.3 436.4,253.21 437.35,252.25 BL43.1
N$44
  Top 0.152: BL43.3 449.1,253.21 452.59,249.72 BL44.1
N$45
  Top 0.152: BL44.3 459.35,246.45 BL45.1
N$46
  Top 0.152: BL45.3 465.65,243.25 BL46.1
N$47
  Top 0.152: BL46.3 471.98,240.01 BL47.1
N$48
  Top 0.152: BL47.3 478.4,236.72 BL48.1
N$49
  Top 0.152: BL48.3 485.09,233.3 BL49.1
N$50  (via drill 0.35)
  Top 0.152: RL1.3 120.13,155.41 v124,159.29 | v125.63,160.26 126.19,160.81 RL2.1
  Bottom 0.152: v124,159.29 124.97,160.26 v125.63,160.26
N$51
  Top 0.152: RL2.3 130.33,161.76 131.28,160.81 RL3.1
N$52
  Top 0.152: BL1.1 4.6,175.73 13.97,166.37 R1.2
N$53  (via drill 0.35)
  Top 0.152: RL3.3 136.74,161.76 v137.55,162.58 | v139.32,162.36 140.87,160.81 RL4.1
  Bottom 0.152: v137.55,162.58 139.1,162.58 v139.32,162.36
N$54
  Top 0.152: RL4.3 154.1,173.15 154.1,184.06 154.98,184.94 RL5.1
N$55
  Top 0.152: RL5.3 157.34,186.55 157.34,187.53 166.19,196.38 RL6.1
N$56
  Top 0.152: RL6.3 177.32,197.32 177.8,196.85 198.44,196.85 RL7.1
N$57  (via drill 0.35)
  Top 0.152: RL7.3 200.08,197.32 v201.91,195.49 | v203.14,194.38 205.55,196.78 222.24,196.78 v223.97,195.05 | v225.5,195.06 226.81,195.06 RL8.1
  Bottom 0.152: v201.91,195.49 203.02,194.38 v203.14,194.38 | v223.97,195.05 v225.49,195.05 v225.5,195.06
N$58  (via drill 0.35)
  Top 0.152: RL8.3 230.29,197.32 v230.66,197.69 | v229.62,195.5 228.23,194.11 v226.34,194.11 | v224.79,193.04 224.05,192.3 215.58,192.3 v215.12,192.76 | v213.36,190.5 207.37,190.5 206.67,191.2 201.27,191.2 v188.7,178.63 | v186.61,175.28 185.9,174.57 v178.6,174.57 | v176.98,174.58 156.95,174.58 155.97,173.61 155.97,171.68 156.21,171.45 157.48,171.45 RL9.1
  Bottom 0.152: v230.66,197.69 230.66,196.54 v229.62,195.5 | v226.34,194.11 225.86,194.11 v224.79,193.04 | v215.12,192.76 213.36,191 v213.36,190.5 | v188.7,178.63 188.7,177.37 v186.61,175.28 | v178.6,174.57 176.99,174.57 v176.98,174.58
N$59
  Top 0.152: RL9.3 163.35,173.19 164.3,172.25 RL10.1
N$60  (via drill 0.35)
  Top 0.152: RL10.3 175.81,173.19 v176.21,173.6 | v179.18,173.6 195.97,173.6 197.32,172.25 RL11.1
  Bottom 0.152: v176.21,173.6 v179.18,173.6
N$61
  Top 0.152: RL11.3 203.99,173.19 204.47,172.72 227.65,172.72 RL12.1
N$62
  Top 0.152: RL12.3 234.39,173.19 238.64,177.44 238.64,192.76 241.45,195.58 244.27,195.58 252.25,203.56 RL13.1
N$63
  Top 0.152: RL13.3 252.73,215.58 252.73,228.92 RL14.1
N$64
  Top 0.152: RL14.3 252.73,230.82 252.73,244.16 RL15.1
N$65  (via drill 0.35)
  Top 0.152: RL15.3 255.26,247.65 264.82,247.65 v270.52,253.35 | v270.73,255.26 270.73,258.03 RL16.1
  Bottom 0.152: v270.52,253.35 270.52,255.05 v270.73,255.26
N$66
  Top 0.152: RL16.3 287.81,270.99 288.76,270.04 RL17.1
N$67
  Top 0.152: RL17.3 301.78,270.99 302.73,270.04 RL18.1
N$68  (via drill 0.35)
  Top 0.152: RL18.3 310.52,270.99 v311.12,271.59 | v313.35,271.68 317.6,271.68 319.24,270.04 RL19.1
  Bottom 0.152: v311.12,271.59 311.21,271.68 v313.35,271.68
N$69
  Top 0.152: RL19.3 328.45,270.99 329.4,270.04 RL20.1
N$70
  Top 0.152: RL20.3 339.88,270.99 340.83,270.04 RL21.1
N$71
  Top 0.152: RL21.3 352.58,270.99 353.53,270.04 RL22.1
N$72
  Top 0.152: RL22.3 365.28,270.99 366.23,270.04 RL23.1
N$73  (via drill 0.35)
  Top 0.152: RL23.3 373.26,271.66 v374.52,271.66 | v378.3,273.08 v382.56,273.08 | v384.9,274.44 398.3,287.84 RL24.1
  Bottom 0.152: v374.52,271.66 375.94,273.08 v378.3,273.08 | v382.56,273.08 383.54,273.08 v384.9,274.44
N$74
  Top 0.152: YL1.3 204.47,127.95 204.47,140.02 YL2.1
N$75
  Top 0.152: RL25.3 399.25,346.24 388.62,356.87 388.14,357.35 386.08,359.41 386.08,365.76 387.51,367.19 RL26.1
N$76
  Top 0.152: RL26.3 389.27,367.36 389.4,367.49 389.4,372.6 373.38,388.62 372.9,389.1 372.11,389.89 372.11,391.97 RL27.1
N$77
  Top 0.152: YL2.3 204.47,141.92 204.47,156.53 YL3.1
N$78  (via drill 0.35)
  Top 0.152: YL3.3 204.47,158.43 204.47,169.24 v203.11,170.59 | v203.1,177.77 203.99,178.66 YL4.1
  Bottom 0.152: v203.11,170.59 203.11,177.76 v203.1,177.77
N$79  (via drill 0.35)
  Top 0.152: YL4.3 204.94,188.61 v203.29,190.27 | v203.34,192.53 205.06,192.53 205.34,192.24 206.68,192.24 209.79,195.35 v209.79,195.9 | v209.63,202.65 209.63,204.05 v206.5,207.19 | v203.54,208.14 203.54,212.44 YL5.1
  Bottom 0.152: v203.29,190.27 203.29,192.48 v203.34,192.53 | v209.79,195.9 209.79,202.49 v209.63,202.65 | v206.5,207.19 204.49,207.19 v203.54,208.14
N$80  (via drill 0.35)
  Top 0.152: YL5.3 204.94,215.42 203.32,217.05 v203.32,221.99 | v203.2,223.52 203.2,237.49 YL6.1
  Bottom 0.152: v203.32,221.99 203.32,223.4 v203.2,223.52
N$81
  Top 0.152: YL6.3 204.94,240.83 204.47,241.3 204.47,263.21 YL7.1
N$82  (via drill 0.35)
  Top 0.152: YL7.3 204.94,272.25 208.28,275.59 v209.55,275.59 | v212.09,275.59 220.98,275.59 226.06,280.67 v253.52,280.67 v253.53,280.67 | v256.53,280.72 257.05,281.24 v257.05,282.29 | v257.76,284.71 260.86,287.81 YL8.1
  Bottom 0.152: v209.55,275.59 v212.09,275.59 | v253.53,280.67 253.58,280.72 v256.53,280.72 | v257.05,282.29 257.05,284 v257.76,284.71
N$83
  Top 0.152: YL8.3 269.9,288.68 269.99,288.77 269.99,291.35 245.11,316.23 244.63,316.71 242.57,318.77 242.57,321.31 243.97,322.71 YL9.1
N$84
  Top 0.152: YL10.1 242.09,331.47 246.38,327.19 246.38,323.06 YL9.3
N$85
  Top 0.152: YL10.3 242.57,334.96 242.57,340.68 YL11.1
N$86
  Top 0.152: YL11.3 242.57,342.58 242.57,348.3 YL12.1
N$87
  Top 0.152: RL24.3 399.25,305.6 398.3,306.55 RL25.1
N$88
  Top 0.152: YL12.3 242.57,350.2 242.57,355.92 YL13.1
N$89
  Top 0.152: YL13.3 243.04,360.21 242.09,361.16 YL14.1
N$90
  Top 0.152: YL14.3 243.04,367.83 242.09,368.78 YL15.1
N$91
  Top 0.152: YL15.3 243.04,375.45 242.09,376.4 YL16.1
N$92
  Top 0.152: YL16.3 243.04,383.06 242.09,384.02 YL17.1
N$93  (via drill 0.35)
  Top 0.152: GL1.3 208.75,130.01 v209.55,130.81 | v211.66,130.82 215.97,130.82 v216,130.85 | v219.24,130.91 219.24,126.67 219.52,126.39 220.37,126.39 GL2.1
  Bottom 0.152: v209.55,130.81 v211.65,130.81 v211.66,130.82 | v216,130.85 219.18,130.85 v219.24,130.91
N$94  (via drill 0.35)
  Top 0.152: GL2.3 221.45,129.92 v219.3,132.07 | v215.94,132.13 211.66,132.13 v211.64,132.12 | v209.83,132.56 207.8,134.59 GL3.1
  Bottom 0.152: v219.3,132.07 216,132.07 v215.94,132.13 | v211.64,132.12 210.28,132.12 v209.83,132.56
N$95  (via drill 0.35)
  Top 0.152: GL3.3 208.75,142.29 v209.99,143.53 | v212.09,143.51 215.49,143.51 v216.18,144.21 | v219.15,144.44 219.22,144.37 219.19,144.35 219.19,140.65 219.35,140.5 GL4.1
  Bottom 0.152: v209.99,143.53 212.07,143.53 v212.09,143.51 | v216.18,144.21 216.41,144.44 v219.15,144.44
N$96  (via drill 0.35)
  Top 0.152: GL4.3 221.45,143.51 v219.11,145.85 | v216.16,146.24 212.37,150.03 v211.42,150.03 | v210,150.33 207.8,152.53 GL5.1
  Bottom 0.152: v219.11,145.85 218.72,146.24 v216.16,146.24 | v211.42,150.03 210.3,150.03 v210,150.33
N$97  (via drill 0.35)
  Top 0.152: GL5.3 208.75,158.85 v209.96,160.06 | v211.76,160.04 214.83,160.04 v216.07,161.28 | v219.2,161.24 219.71,160.73 219.71,157.48 220.18,157 GL6.1
  Bottom 0.152: v209.96,160.06 211.75,160.06 v211.76,160.04 | v216.07,161.28 219.15,161.28 v219.2,161.24
N$98  (via drill 0.35)
  Top 0.152: GL6.3 221.45,160.43 v219.3,162.58 | v216.13,162.51 212.05,166.59 v212.05,170.38 | v211.98,177.77 211.98,179.64 v211.72,179.9 | v210.21,180.97 207.8,183.38 GL7.1
  Bottom 0.152: v219.3,162.58 216.2,162.58 v216.13,162.51 | v212.05,170.38 212.05,177.7 v211.98,177.77 | v211.72,179.9 211.28,179.9 v210.21,180.97
N$99
  Top 0.152: R2.2 110.28,154.47 RL1.1
N$100
  Top 0.152: GL7.3 212.31,187.16 216.37,191.23 218.98,191.23 219.71,190.5 219.71,186.69 220.18,186.22 GL8.1
N$101  (via drill 0.35)
  Top 0.152: GL8.3 221.45,190.21 v222.33,191.09 | v219.98,193.54 219.19,194.33 v219.05,194.33 | v216.03,194.89 215.06,195.86 v211.57,195.86 | v211,202.67 210.82,202.85 210.82,207.54 207.64,210.72 207.64,212.72 GL9.1
  Bottom 0.152: v222.33,191.09 219.98,193.44 v219.98,193.54 | v219.05,194.33 216.59,194.33 v216.03,194.89 | v211.57,195.86 211,196.43 v211,202.67
N$102  (via drill 0.35)
  Top 0.152: GL9.3 209.35,214.43 v209.9,214.43 | v211.56,214.38 214.99,210.95 v216.11,210.95 | v219.07,210.9 219.07,211.45 GL10.1
  Bottom 0.152: v209.9,214.43 211.5,214.43 v211.56,214.38 | v216.11,210.95 219.02,210.95 v219.07,210.9
N$103  (via drill 0.35)
  Top 0.152: GL10.3 221.45,214.89 v219.83,216.51 | v219.67,217.98 219.67,220.44 v219.59,220.53 | v219.7,223.6 219.7,227.09 v219.24,227.55 | v215.22,228.24 207.8,235.66 GL11.1
  Bottom 0.152: v219.83,216.51 219.67,216.67 v219.67,217.98 | v219.59,220.53 219.59,223.48 v219.7,223.6 | v219.24,227.55 215.91,227.55 v215.22,228.24
N$104  (via drill 0.35)
  Top 0.152: GL11.3 208.75,241.93 v210.17,243.35 | v211.47,243.45 216.2,243.45 v216.24,243.41 | v218.25,243.41 218.84,242.83 218.84,238.76 219.71,238.76 220.34,238.12 GL12.1
  Bottom 0.152: v210.17,243.35 210.27,243.45 v211.47,243.45 | v216.24,243.41 v218.25,243.41
N$105  (via drill 0.35)
  Top 0.152: GL12.3 220.98,239.71 220.98,248.78 v211.82,257.94 | v209.79,259.2 207.8,261.18 GL13.1
  Bottom 0.152: v211.82,257.94 211.04,257.94 v209.79,259.2
N$106
  Top 0.152: GL13.3 211.9,267.78 218.81,267.78 219.1,267.5 219.1,264.53 219.94,263.69 GL14.1
N$107  (via drill 0.35)
  Top 0.152: GL14.3 236.19,279.38 v255.3,279.38 | v258.14,279.56 272.52,279.56 v272.92,279.95 | v275.67,279.91 278.89,279.91 281.14,277.66 GL15.1
  Bottom 0.152: v255.3,279.38 255.48,279.56 v258.14,279.56 | v272.92,279.95 275.62,279.95 v275.67,279.91
N$108
  Top 0.152: GL15.3 289.08,278.61 290.03,277.66 GL16.1
N$109
  Top 0.152: GL16.3 301.78,278.61 302.73,277.66 GL17.1
N$110  (via drill 0.35)
  Top 0.152: GL17.3 309.67,279.2 v310.17,279.2 | v311.94,279.27 315.09,279.27 316.7,277.66 GL18.1
  Bottom 0.152: v310.17,279.2 311.87,279.2 v311.94,279.27
N$111
  Top 0.152: GL18.3 328.45,278.61 329.4,277.66 GL19.1
N$112
  Top 0.152: GL19.3 339.88,278.61 340.83,277.66 GL20.1
N$113
  Top 0.152: GL20.3 352.58,278.61 353.53,277.66 GL21.1
N$114
  Top 0.152: GL21.3 365.28,278.61 366.23,277.66 GL22.1
N$115  (via drill 0.35)
  Top 0.152: GL22.3 383.7,278.61 v385.81,276.5 | v387.06,275.38 390.06,272.38 v391.66,272.38 | v393.66,271.85 396.26,269.25 v396.26,260.41 | v395.23,258.99 393.02,256.78 v393.02,255.83 | v391.74,254.7 391.74,242.63 v391.24,242.12 | v391.12,240.56 389.31,238.76 v388.62,238.76 | v387.44,237.81 387.44,231.37 GL23.1
  Bottom 0.152: v385.81,276.5 386.92,275.38 v387.06,275.38 | v391.66,272.38 393.13,272.38 v393.66,271.85 | v396.26,260.41 396.26,260.01 v395.23,258.99 | v393.02,255.83 391.9,254.7 v391.74,254.7 | v391.24,242.12 391.24,240.68 v391.12,240.56 | v388.62,238.76 387.67,237.81 v387.44,237.81
N$116  (via drill 0.35)
  Top 0.152: GL24.3 388.3,207.01 v387.35,207.01 | v385.94,207 385.94,180.55 388.06,178.43 389.25,178.43 GL25.1
  Bottom 0.152: v387.35,207.01 385.95,207.01 v385.94,207
N$117  (via drill 0.35)
  Top 0.152: GL25.3 392.36,177.54 v392.36,164.53 | v388.63,163.72 386.08,161.17 386.08,153.67 386.55,153.19 GL26.1
  Bottom 0.152: v392.36,164.53 391.56,163.72 v388.63,163.72
N$118  (via drill 0.35)
  Top 0.152: GL26.3 390.36,156 v387.08,159.28 | v385.13,159.02 385.13,131.76 389.09,127.79 GL27.1
  Bottom 0.152: v387.08,159.28 386.82,159.02 v385.13,159.02
N$119  (via drill 0.35)
  Top 0.152: GL27.3 390.36,131.73 v386.12,135.96 | v384.25,135.92 384.25,105.94 387.95,102.24 389.26,102.24 GL28.1
  Bottom 0.152: v386.12,135.96 384.29,135.96 v384.25,135.92
N$120  (via drill 0.35)
  Top 0.152: GL28.3 390.36,103.95 v385.16,109.16 | v383.36,109.07 383.36,81.46 387.82,77 GL29.1
  Bottom 0.152: v385.16,109.16 383.44,109.16 v383.36,109.07
N$121  (via drill 0.35)
  Top 0.152: GL29.3 390.36,78.59 v383.96,84.99 | v382.41,83.98 382.41,57.01 387.82,51.6 GL30.1
  Bottom 0.152: v383.96,84.99 382.96,83.98 v382.41,83.98
N$122
  Top 0.152: OL1.3 325.12,8.57 325.12,21.91 OL2.1
N$123  (via drill 0.35)
  Top 0.152: GL23.3 390.36,231.37 v388.45,233.28 | v386.58,233.29 386.58,203.97 387.35,203.2 388.62,203.2 GL24.1
  Bottom 0.152: v388.45,233.28 388.44,233.29 v386.58,233.29
N$124
  Top 0.152: OL2.3 325.12,23.81 325.12,37.15 OL3.1
N$125
  Top 0.152: OL3.3 325.59,45.24 324.64,46.2 OL4.1
N$126
  Top 0.152: R3.2 194.83,126.53 YL1.1
N$127
  Top 0.152: OL4.3 325.59,63.02 324.64,63.98 OL5.1
N$128
  Top 0.152: OL5.3 325.59,78.27 324.64,79.22 OL6.1
N$129
  Top 0.152: OL6.3 325.59,87.16 321.49,91.26 319.59,91.26 318.29,92.55 OL7.1
N$130
  Top 0.152: OL7.3 314.64,99.06 303.85,99.06 OL8.1
N$131
  Top 0.152: OL8.3 302.73,103.66 302.26,104.14 297.18,104.14 281.94,88.9 248.92,88.9 247.65,87.63 247.65,83.82 250.19,81.28 251.46,81.28 OL9.1
N$132  (via drill 0.35)
  Top 0.152: OL9.3 v248.75,87.47 v248.75,87.48 | v247.65,88.9 226.85,109.7 226.85,123.19 225.3,124.74 224.5,124.74 220.61,120.85 220.61,119.82 221.53,118.91 OL10.1
  Bottom 0.152: v248.75,87.48 247.65,88.59 v247.65,88.9
N$133  (via drill 0.35)
  Top 0.152: OL10.3 223.99,122.28 v223.55,122.72 | v221.57,122.79 216.5,122.79 v215.91,122.2 | v215.67,123.9 215.67,125.5 OL11.1
  Bottom 0.152: v223.55,122.72 221.65,122.72 v221.57,122.79 | v215.91,122.2 215.67,122.45 v215.67,123.9
N$134
  Top 0.152: OL11.3 217.64,132.34 216.69,133.29 OL12.1
N$135
  Top 0.152: OL12.3 217.64,145.88 217.19,146.33 217.19,156.5 OL13.1
N$136  (via drill 0.35)
  Top 0.152: OL13.3 217.64,162.71 216.1,164.25 v216.1,170.36 | v216.16,177.83 216.16,185.68 OL14.1
  Bottom 0.152: v216.1,170.36 216.1,177.77 v216.16,177.83
N$137  (via drill 0.35)
  Top 0.152: OL14.3 217.64,188.45 v216.17,189.92 | v216.07,193.42 214.45,195.04 v214.45,195.08 | v215.41,199.37 213.06,199.37 v212.71,199.72 | v212.84,202.66 212.84,205.66 217.18,210 217.18,211.78 216.69,212.27 OL15.1
  Bottom 0.152: v216.17,189.92 216.17,193.32 v216.07,193.42 | v214.45,195.08 214.45,198.42 v215.41,199.37 | v212.71,199.72 212.71,202.53 v212.84,202.66
N$138  (via drill 0.35)
  Top 0.152: OL15.3 212.32,219.16 v211.77,219.16 | v210.07,219.12 209.43,219.77 v209.43,222.09 | v209.38,223.73 209.38,229.07 v211.27,230.96 | v212.42,232.02 213.1,232.69 v213.1,232.72 | v214.15,233.85 216.69,236.39 OL16.1
  Bottom 0.152: v211.77,219.16 210.12,219.16 v210.07,219.12 | v209.43,222.09 209.43,223.69 v209.38,223.73 | v211.27,230.96 212.32,232.02 v212.42,232.02 | v213.1,232.72 213.1,232.79 v214.15,233.85
N$139  (via drill 0.35)
  Top 0.152: OL16.3 217.64,251.02 v215.88,252.78 | v216.13,254.55 216.13,263.12 OL17.1
  Bottom 0.152: v215.88,252.78 215.88,254.31 v216.13,254.55
N$140
  Top 0.152: R5.2 321.31,13.7 321.31,8.89 323.05,7.15 OL1.1
N$141
  Top 0.152: U1.13 178.48,27.91 IC1.2
N$142
  Top 0.152: U1.12 188.67,40.64 170.18,40.64 165.1,35.56 165.1,30.48 163.18,28.56 IC1.3
N$143
  Top 0.152: R4.2 199.39,116.84 205.74,123.19 207.01,123.19 207.8,123.98 GL1.1
N$144
  Top 0.152: U1.11 189.94,41.91 167.64,41.91 163.83,38.1 163.83,31.75 161.29,29.21 IC1.4
N$145  (via drill 0.35)
  Top 0.152: U1.10 191.21,43.18 166.37,43.18 161.29,38.1 161.29,31.75 v160.02,30.48 | v158.75,26.67 153.67,21.59 v129.54,21.59 | v127,21.59 123.81,18.4 IC2.3
  Bottom 0.152: v160.02,30.48 160.02,27.94 v158.75,26.67 | v129.54,21.59 v127,21.59
N$146
  Top 0.152: U1.7 183.56,17.75 IC2.2
ORANGE_LINE  (via drill 0.35)
  Top 0.152: IC2.13 107.92,17.75 105.41,15.24 105.41,12.7 111.76,6.35 268.87,6.35 v274.34,11.81 | v276.23,13.74 284.08,21.59 R5.1
  Bottom 0.152: v274.34,11.81 276.23,13.7 v276.23,13.74
RED_LINE  (via drill 0.35)
  Top 0.152: IC1.12 108.6,28.56 87.63,49.53 v87.63,53.34 | v87.63,58.42 96.52,67.31 v96.52,109.22 | v96.52,114.3 96.52,138.7 R2.1
  Bottom 0.152: v87.63,53.34 v87.63,58.42 | v96.52,109.22 v96.52,114.3
YELLOW_LINE  (via drill 0.35)
  Top 0.152: v97.79,58.42 152.4,113.03 v152.4,114.3 | v153.67,118.11 157.48,121.92 R3.1 | IC1.11 109.22,29.21 97.79,40.64 v97.79,53.34
  Bottom 0.152: v97.79,53.34 v97.79,58.42 | v152.4,114.3 152.4,116.84 v153.67,118.11

## Text on the board
tNames: Portland Airport | Expo Center | TriMet Transit Tracker V2.1 | Delta Park/Vanport | Kenton/Denver | Mt Hood | N Lombard Transit Center | Rosa Parks | N Killingsworth | Cascades | N Prescott | Overlook Park | Albina/Mississippi | Parkrose/Summer Transit Center | Interstate / Rose Quarter | Rose Quarter Transit Center | Convention Center | NE 7th | Lloyd Center/NE 11th | Hollywood Transit Center | NE 60th | NE 82nd | Gateway/NE 99th / Transit Center | NW Hoyt | NW Glisan | E 102nd | E 122nd | E 148th | E 162nd | E 172nd | E 181st | Rockwood/E 188th | Ruby Junction/E 197th | Civic Dr | Gresham City Hall | Old Town / Chinatown | NW Davis | NW Couch | SE Main | Skidmore / Fountain | SW Pine | Cleveland | Oak/SW 1st | SW Oak | Galleria / SW 10th | Pioneer / Square N | SW 3rd | SE Division | Hatfield Government Center | Hillsboro Cenral/SE 3rd Transit Center | Tuality Hospital/SE 8th | Washington/SE 12th | Fair Complex/Hillsboro Airport | Hawthorn Farm | Orenco | Quatama | Pioneer Courthouse | Pioneer Place | Willow Creek/SW 185th Transit Center | Providence Park | Gresham Central Transit Center | Elmonica/SW 17th | SE Powell | Merlo/SW 158th | Beaverton Creek | Sunset Transit Center | Washington Park | Millikan Way | Library / SW 9th | Pioneer / Square S | Yamhill / District | Beaverton Central | Beaverton Transit Center | SW Madison | City Hall / SW Jefferson | Goose Hollow / SW Jefferson | SE Holgate | SW Montgomery | SW Mill | SW College | Lents Town Center/SE Foster | SW Jackson | Lincoln / SW 3rd | SE Flavel | Clinton/SE 12th | OMSI / SE Water | SE 17th & Rhine | SE Fuller | South Waterfront / S Moody | SE 17th & Holgate | SE Bybee | Clackamas Town Center Transit Center | SE Tacoma/Johnson Creek | Milwaukie/Main | SE Park
bNames: JLCJLCJLCJLC